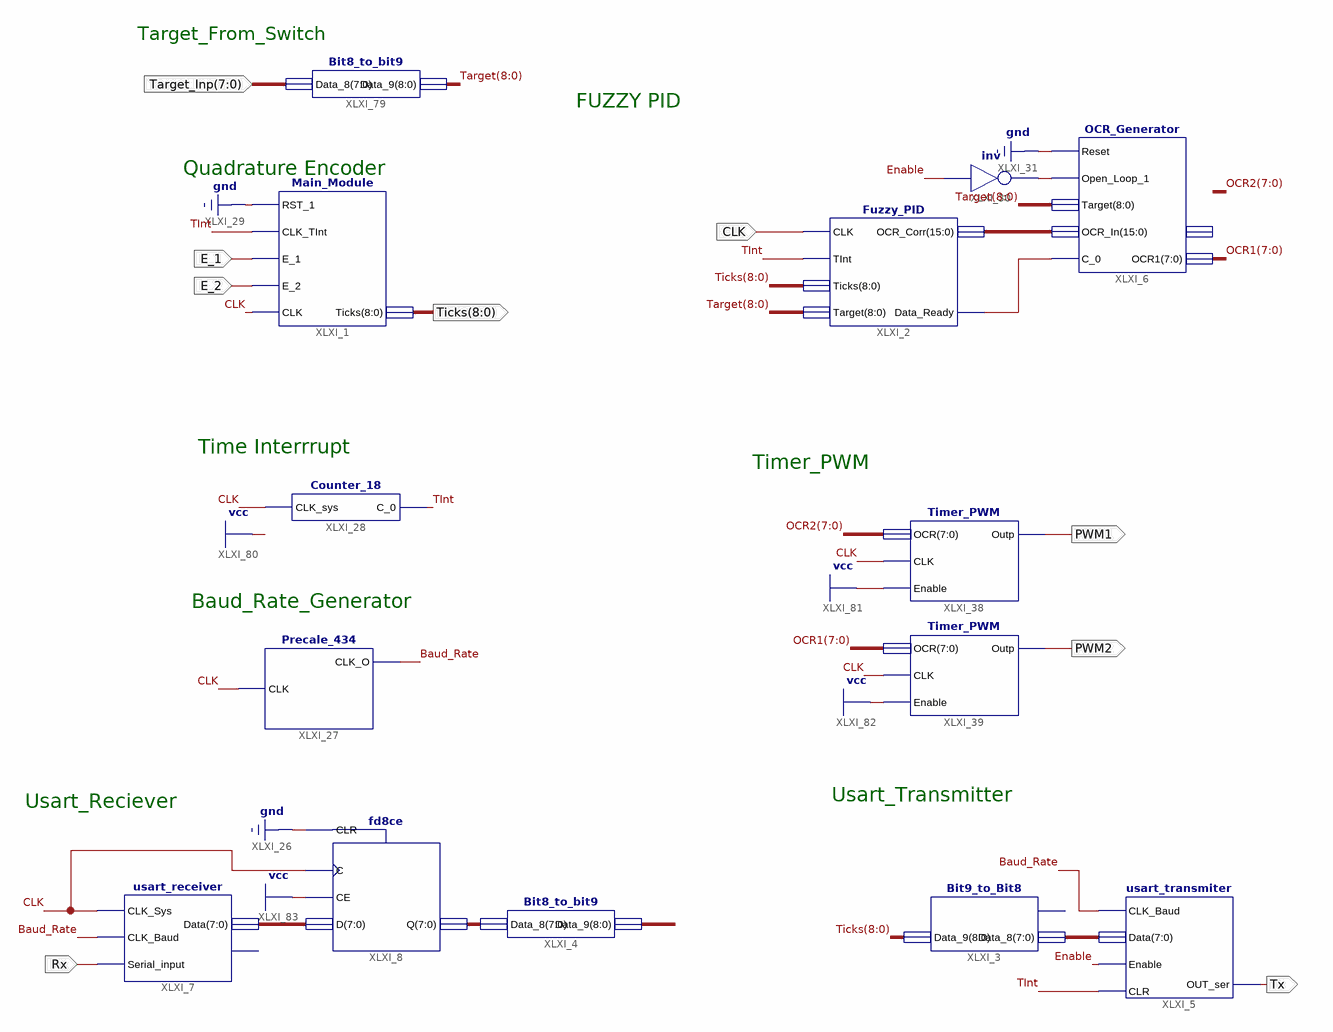
[diagram p0: schematic sheet 1]
// Xilinx ISE schematic FIRA_2_0.sch (spartan3e) as structural Verilog: 14 symbols, 9 ports
module FIRA_2_0 (
  input  CLK,
  input  E_2,
  input  E_1,
  input  Rx,
  input  [7:0] Target_Inp,
  output [8:0] Ticks,
  output PWM1,
  output PWM2,
  output Tx
);

  wire Baud_Rate, TInt, XLXN_8, XLXN_74;
  wire [7:0] OCR1, OCR2, XLXN_4, XLXN_11, XLXN_12;
  wire [8:0] Target, XLXN_225;
  wire [15:0] XLXN_7;

  not XLXI_30 (XLXN_74, 1'b1);
  OCR_Generator XLXI_6 (
    .C_0(XLXN_8), .OCR_In(XLXN_7), .Target(Target), .Open_Loop_1(XLXN_74), .Reset(1'b0), .OCR1(OCR1));  // open: OCR2
  Fuzzy_PID XLXI_2 (.Target(Target), .Ticks(Ticks), .TInt(TInt), .CLK(CLK), .Data_Ready(XLXN_8), .OCR_Corr(XLXN_7));
  Main_Module XLXI_1 (.CLK(CLK), .E_2(E_2), .E_1(E_1), .Ticks(Ticks), .CLK_TInt(TInt), .RST_1(1'b0));
  Precale_434 XLXI_27 (.CLK(CLK), .CLK_O(Baud_Rate));
  Timer_PWM XLXI_39 (.OCR(OCR1), .CLK(CLK), .Enable(1'b1), .Outp(PWM2));
  Timer_PWM XLXI_38 (.OCR(OCR2), .CLK(CLK), .Enable(1'b1), .Outp(PWM1));
  fd8ce XLXI_8 (.C(CLK), .CE(1'b1), .CLR(1'b0), .D(XLXN_11), .Q(XLXN_12));
  Bit8_to_bit9 XLXI_4 (.Data_8(XLXN_12), .Data_9(XLXN_225));
  usart_receiver XLXI_7 (.CLK_Baud(Baud_Rate), .Serial_input(Rx), .CLK_Sys(CLK), .Data(XLXN_11));  // open: Parity_ERR
  usart_transmiter XLXI_5 (.OUT_ser(Tx), .Enable(1'b1), .CLK_Baud(Baud_Rate), .Data(XLXN_4), .CLR(TInt));
  Bit9_to_Bit8 XLXI_3 (.Data_9(Ticks), .Data_8(XLXN_4));  // open: OFL
  Counter_18 XLXI_28 (.CLK_sys(CLK), .C_0(TInt));
  Bit8_to_bit9 XLXI_79 (.Data_8(Target_Inp), .Data_9(Target));

  // Notes on the sheet:
  //   Target_From_Switch
  //   FUZZY PID
  //   Quadrature Encoder
  //   Time Interrrupt
  //   Timer_PWM
  //   Baud_Rate_Generator
  //   Usart_Transmitter
  //   Usart_Reciever
endmodule
